# EAGLE design control_psw (EAGLE 7.4.0)
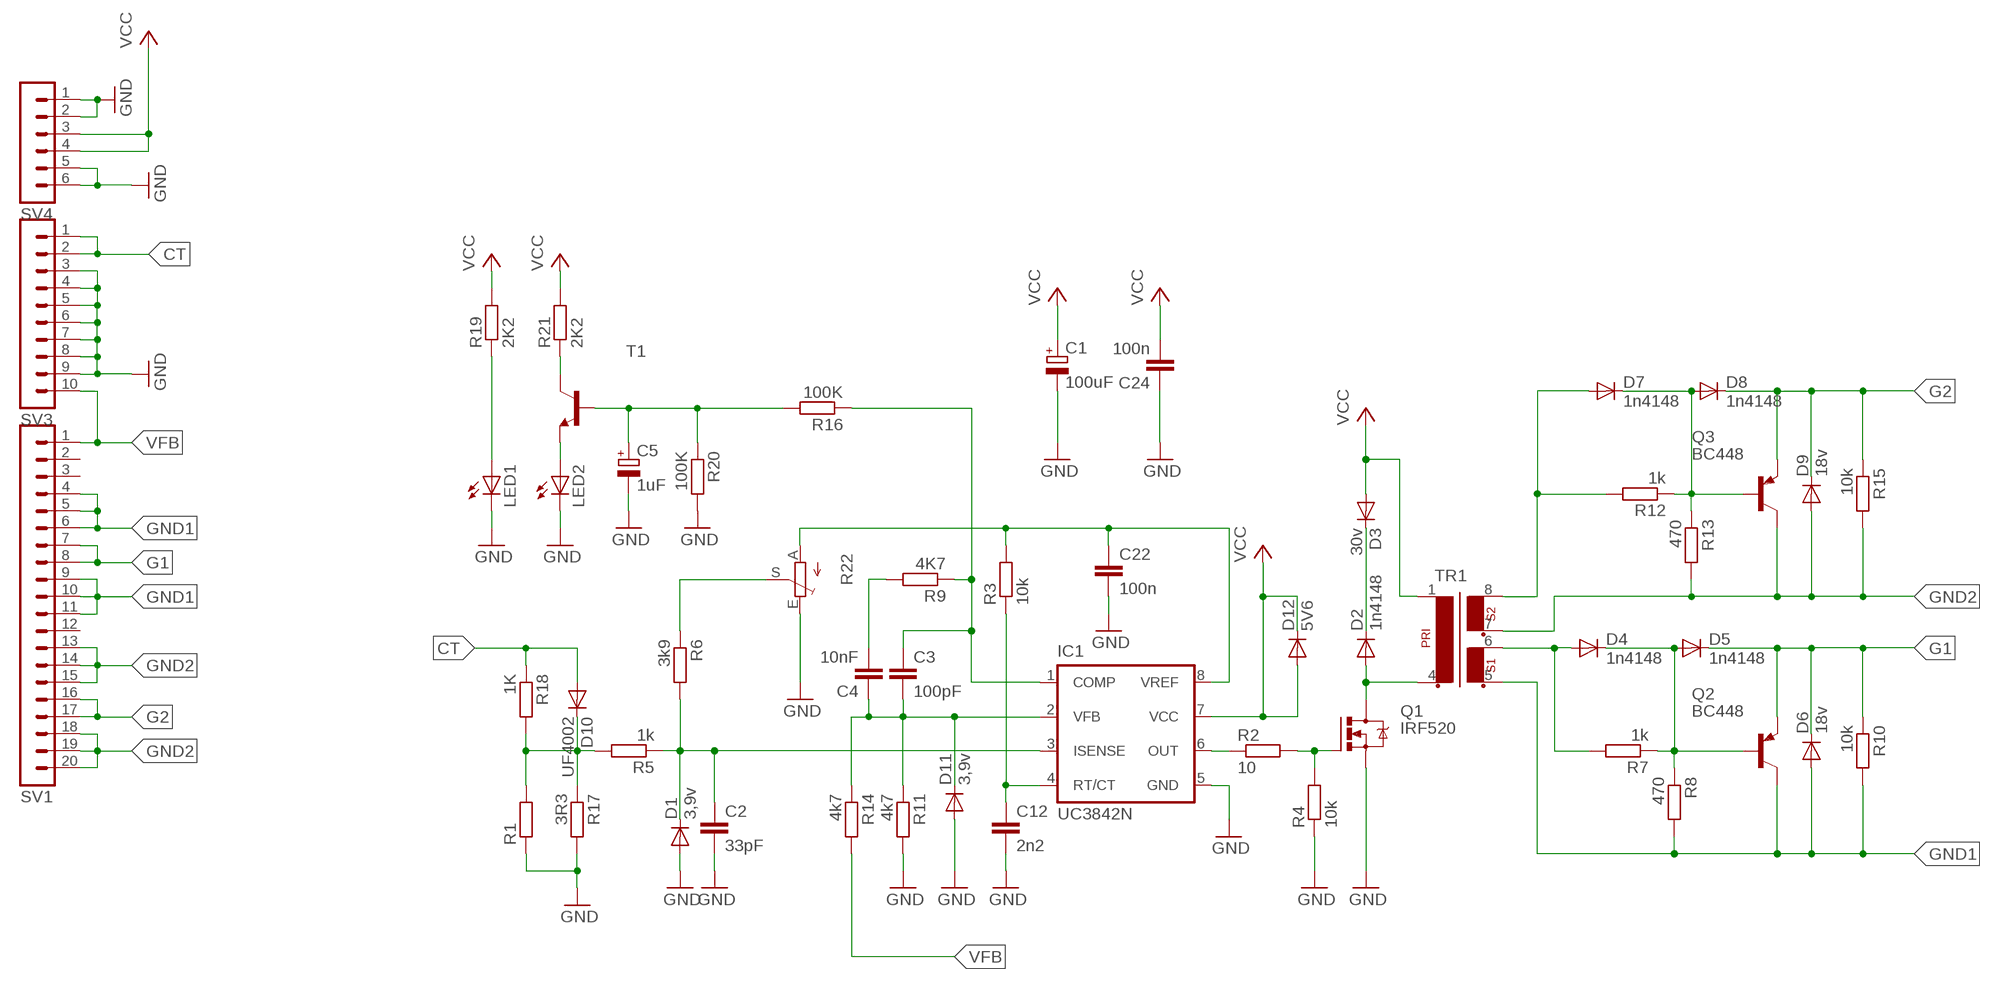
[diagram p0: schematic, sheet 1]

## Parts
C1  100uF  CPOL-EUE5-6  [E5-6]
C2  33pF  C-EU050-025X075  [C050-025X075]
C3  100pF  C-EU050-025X075  [C050-025X075]
C4  10nF  C-EU050-025X075  [C050-025X075]
C5  1uF  CPOL-EUE5-6  [E5-6]
C12  2n2  C-EU050-025X075  [C050-025X075]
C22  100n  C-EU050-025X075  [C050-025X075]
C24  100n  C-EU050-025X075  [C050-025X075]
D1  3,9v  1N4446  [DO35-10]
D2  1n4148  1N4446  [DO35-10]
D3  30v  1N4446  [DO35-10]
D4  1n4148  1N4446  [DO35-10]
D5  1n4148  1N4446  [DO35-10]
D6  18v  1N4446  [DO35-10]
D7  1n4148  1N4446  [DO35-10]
D8  1n4148  1N4446  [DO35-10]
D9  18v  1N4446  [DO35-10]
D10  UF4002  1N4446  [DO35-10]
D11  3,9v  1N4446  [DO35-10]
D12  5V6  1N4446  [DO35-10]
IC1  UC3842N  [DIL08]
LED1  LED5MM  [LED5MM]
LED2  LED5MM  [LED5MM]
Q1  IRF520  [TO220BV]
Q2  BC448  [TO92-EBC]
Q3  BC448  [TO92-EBC]
R1  R-EU_0411/12  [0411/12]
R2  10  R-EU_0207/10  [0207/10]
R3  10k  R-EU_0207/10  [0207/10]
R4  10k  R-EU_0207/10  [0207/10]
R5  1k  R-EU_0207/10  [0207/10]
R6  3k9  R-EU_0207/10  [0207/10]
R7  1k  R-EU_0207/10  [0207/10]
R8  470  R-EU_0207/10  [0207/10]
R9  4K7  R-EU_0207/10  [0207/10]
R10  10k  R-EU_0207/10  [0207/10]
R11  4k7  R-EU_0207/10  [0207/10]
R12  1k  R-EU_0207/10  [0207/10]
R13  470  R-EU_0207/10  [0207/10]
R14  4k7  R-EU_0207/10  [0207/10]
R15  10k  R-EU_0207/10  [0207/10]
R16  100K  R-EU_0207/10  [0207/10]
R17  3R3  R-EU_0207/10  [0207/10]
R18  1K  R-EU_0207/10  [0207/10]
R19  2K2  R-EU_0207/10  [0207/10]
R20  100K  R-EU_0207/10  [0207/10]
R21  2K2  R-EU_0207/10  [0207/10]
R22  TRIM_EU-RJ9W  [RJ9W]
SV1  MA20-1  [MA20-1]
SV3  MA10-1  [MA10-1]
SV4  MA06-1  [MA06-1]
T1  BC547-NPN-TO92-CBE  [TO92-CBE]
TR1  EE20-2  [EE20-2]

## Nets
CT: D10.A R18.1 SV3.1 SV3.2
G1: D5.C D6.C Q2.E R10.1 SV1.7 SV1.8
G2: D8.C D9.C Q3.E R15.1 SV1.16 SV1.17
GND: C1.- C2.2 C5.- C12.2 C22.2 C24.1 D1.A D11.A IC1.5(GND) LED1.K(C) LED2.K(C) Q1.S R1.1 R4.1 R11.2 R17.2 R20.2 R22.E SV3.3 SV3.4 SV3.5 SV3.6 SV3.7 SV3.8 SV3.9 SV4.1 SV4.2 SV4.5 SV4.6
GND1: D6.A Q2.C R8.2 R10.2 SV1.4 SV1.5 SV1.6 SV1.9 SV1.10 SV1.11 TR1.5
GND2: D9.A Q3.C R13.2 R15.2 SV1.13 SV1.14 SV1.15 SV1.18 SV1.19 SV1.20 TR1.7
N$1: C22.1 IC1.8(VREF) R3.2 R22.A
N$2: C12.1 IC1.4(RT/CT) R3.1
N$3: IC1.6(OUT) R2.1
N$4: Q1.G R2.2 R4.2
N$5: C2.1 D1.C IC1.3(ISENSE) R5.1 R6.2
N$6: D2.A Q1.D TR1.4
N$7: R6.1 R22.S
N$8: D2.C D3.C
N$9: LED1.A R19.1
N$10: C3.1 IC1.1(COMP) R9.1 R16.1
N$11: D4.C D5.A Q2.B R7.1 R8.1
N$12: D4.A R7.2 TR1.6
N$14: C3.2 C4.1 D11.C IC1.2(VFB) R11.1 R14.1
N$15: C4.2 R9.2
N$16: LED2.A T1.E
N$17: D7.C D8.A Q3.B R12.1 R13.1
N$18: D7.A R12.2 TR1.8
N$20: R21.1 T1.C
N$22: D10.C R1.2 R5.2 R17.1 R18.2
N$24: C5.+ R16.2 R20.1 T1.B
VCC: C1.+ C24.2 D3.A D12.A D12.C IC1.7(VCC) R19.2 R21.2 SV4.3 SV4.4 TR1.1
VFB: R14.2 SV1.1 SV3.10
Unconnected: SV1.2 SV1.3 SV1.12

## Library data of the parts
C1 C5 = rcl:CPOL-EU: POLARIZED CAPACITOR, European symbol
C2-C4 C12 C22 C24 = rcl:C-EU: CAPACITOR, European symbol
D1-D12 = diode:1N4446: DIODE high speed (Philips)
IC1 = v-reg:UC384*: SMPS Controller Source: http://www.fairchildsemi.com/ds/UC/UC3843.pdf
LED1 LED2 = led:LED: LED OSRAM: - CHIPLED LG R971, LG N971, LY N971, LG Q971, LY Q971, LO R971, LY R971 LH N974, LH R974 LS Q976, LO Q976, LY Q976 LO Q996 - Hyper CHIPLED LW Q18S LB Q993, LB Q99A, LB R99A - SideLED LS A670, LO A670, LY A670, LG A670, LP A670 LB A673, LV A673, LT A673, LW A673 LH A674 LY A675 LS A676, LA A676, LO A676, LY A676, LW A676 LS A679, LY A679, LG A679 - Hyper Micro SIDELED® LS Y876, LA Y876, LO Y876, LY Y876 LT Y87S - SmartLED LW L88C, LW L88S LB L89C, LB L89S, LG L890 LS L89K, LO L89K, LY L89K LS L896, LA L896, LO L896, LY L896 - TOPLED LS T670, LO T670, LY T670, LG T670, LP T670 LSG T670, LSP T670, LSY T670, LOP T670, LYG T670 LG T671, LOG T671, LSG T671 LB T673, LV T673, LT T673, LW T673 LH T674 LS T676, LA T676, LO T676, LY T676, LB T676, LH T676, LSB T676, LW T676 LB T67C, LV T67C, LT T67C, LS T67K, LO T67K, LY T67K, LW E67C LS E67B, LA E67B, LO E67B, LY E67B, LB E67C, LV E67C, LT E67C LW T67C LS T679, LY T679, LG T679 LS T770, LO T770, LY T770, LG T770, LP T770 LB T773, LV T773, LT T773, LW T773 LH T774 LS E675, LA E675, LY E675, LS T675 LS T776, LA T776, LO T776, LY T776, LB T776 LHGB T686 LT T68C, LB T68C - Hyper Mini TOPLED® LB M676 - Mini TOPLED Santana® LG M470 LS M47K, LO M47K, LY M47K Source: http://www.osram.convergy.de LUXEON: - LUMILED® LXK2-PW12-R00, LXK2-PW12-S00, LXK2-PW14-U00, LXK2-PW14-V00 LXK2-PM12-R00, LXK2-PM12-S00, LXK2-PM14-U00 LXK2-PE12-Q00, LXK2-PE12-R00, LXK2-PE12-S00, LXK2-PE14-T00, LXK2-PE14-U00 LXK2-PB12-K00, LXK2-PB12-L00, LXK2-PB12-M00, LXK2-PB14-N00, LXK2-PB14-P00, LXK2-PB14-Q00 LXK2-PR12-L00, LXK2-PR12-M00, LXK2-PR14-Q00, LXK2-PR14-R00 LXK2-PD12-Q00, LXK2-PD12-R00, LXK2-PD12-S00 LXK2-PH12-R00, LXK2-PH12-S00 LXK2-PL12-P00, LXK2-PL12-Q00, LXK2-PL12-R00 Source: www.luxeon.com KINGBRIGHT: KA-3528ASYC Source: www.kingbright.com
Q1 = transistor-power:IRF520: HEXFET Power MOSFET
Q2 Q3 = transistor-pnp:BC448*: PNP Transistror
R1-R21 = rcl:R-EU_: RESISTOR, European symbol
R22 = pot:TRIM_EU-: POTENTIOMETER
SV1 = con-lstb:MA20-1: PIN HEADER; OC_FARNELL: unknown; OC_NEWARK: unknown
SV3 = con-lstb:MA10-1: PIN HEADER; OC_FARNELL: unknown; OC_NEWARK: unknown
SV4 = con-lstb:MA06-1: PIN HEADER; OC_FARNELL: unknown; OC_NEWARK: unknown
T1 = transistor:*-NPN-: NPN Transistror BF959 corrected 2008.03.06
TR1 = trafo:EE20-2: TRANSFORMER 1 primary winding, 2 secondary windings ERA

## Board
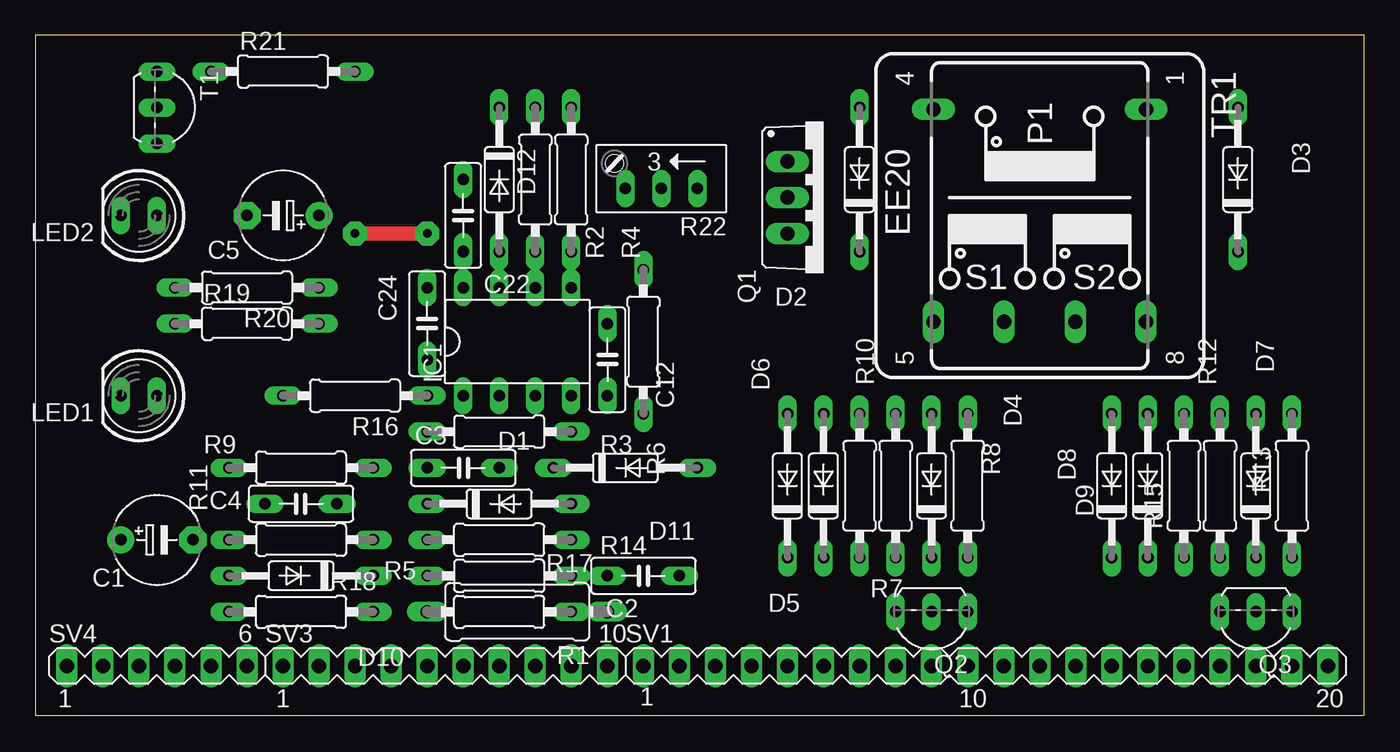
[diagram p1: board, top side]
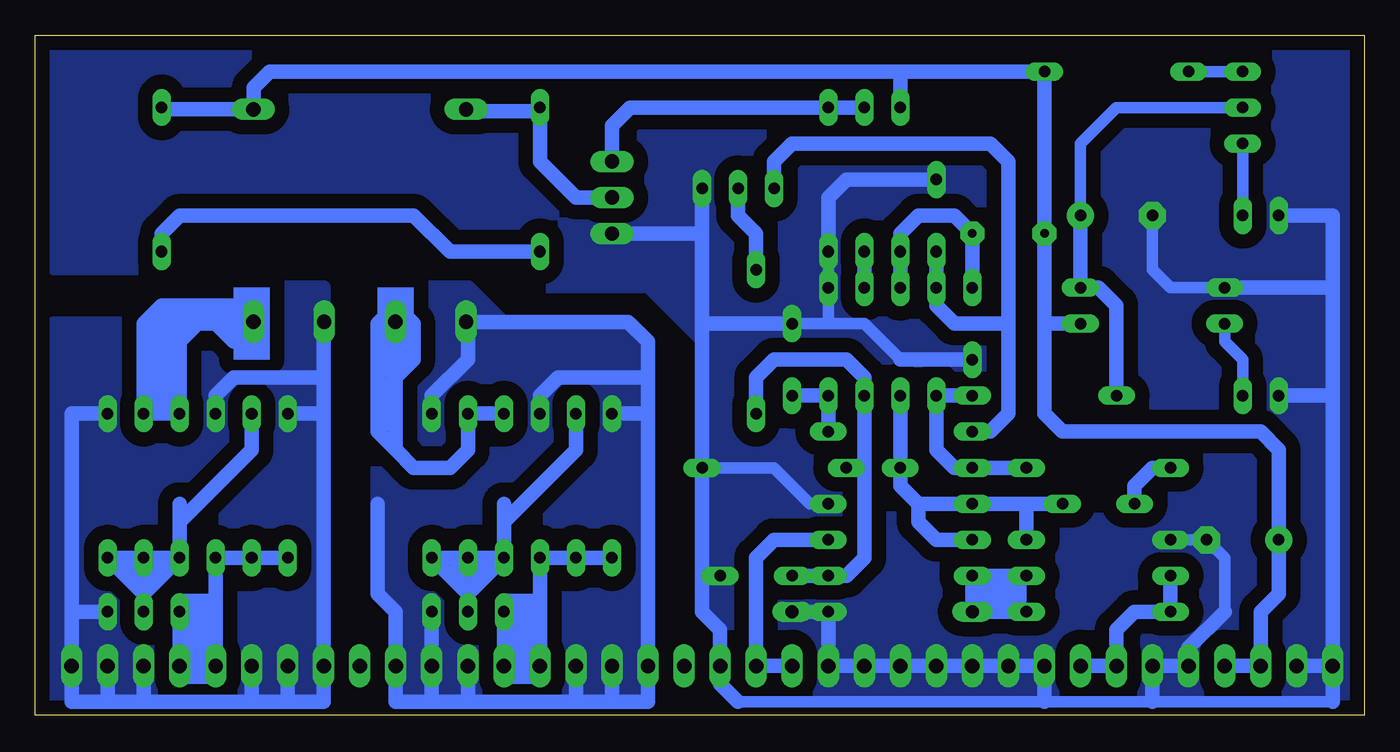
[diagram p2: board, bottom side, seen from below]

Size 93.65 x 47.93 mm. Coordinates in mm from the lower left corner, seen from the top.
Outline: 93.65,47.93 0,47.93 0,0 93.65,0 93.65,47.93
Copper layers (1*16): Top 0.035mm / dielectric 1.5mm / Bottom 0.035mm
Design rules "default": minimum track width 10mil, minimum drill 24mil, track to track 8mil, track to pad 8mil, pad to pad 8mil, via to via 8mil, smd to smd 8mil, copper to edge 40mil, drill to drill 8mil, minimum pad ring 10mil, minimum via ring 8mil, stop-mask expansion 4mil, vias tented up to drill 0mil, thermal gap 10mil

### Footprints (pad centres in the part's own frame; a part is rotated, then mirrored left to right if it is on the bottom)
E5-6 = drill 0.813 pad 1.905: + -2.54,0 | drill 0.813 pad 1.905 octagon: - 2.54,0
C050-025X075 = drill 0.813 long: 1 -2.54,0; 2 2.54,0
DO35-10 = drill 0.813 long: A 5.08,0; C -5.08,0
DIL08 = drill 0.813 long: 1 -3.81,-3.81; 2 -1.27,-3.81; 3 1.27,-3.81; 4 3.81,-3.81; 5 3.81,3.81; 6 1.27,3.81; 7 -1.27,3.81; 8 -3.81,3.81
LED5MM = drill 0.813 long: A -1.27,0; K 1.27,0
TO220BV = drill 1.016 long: D 0,-2.54; G -2.54,-2.54; S 2.54,-2.54
TO92-EBC = drill 0.813 long: B 0,-1.27; C -2.54,-1.27; E 2.54,-1.27
0411/12 = drill 0.914 long: 1 -6.35,0; 2 6.35,0
0207/10 = drill 0.813 long: 1 -5.08,0; 2 5.08,0
RJ9W = drill 0.813 long: A 2.54,0.635; E -2.54,0.635; S 0,0.635
MA20-1 = drill 1.016 long: 1 -24.13,0; 2 -21.59,0; 3 -19.05,0; 4 -16.51,0; 5 -13.97,0; 6 -11.43,0; 7 -8.89,0; 8 -6.35,0; 9 -3.81,0; 10 -1.27,0; 11 1.27,0; 12 3.81,0; 13 6.35,0; 14 8.89,0; 15 11.43,0; 16 13.97,0; 17 16.51,0; 18 19.05,0; 19 21.59,0; 20 24.13,0
MA10-1 = drill 1.016 long: 1 -11.43,0; 2 -8.89,0; 3 -6.35,0; 4 -3.81,0; 5 -1.27,0; 6 1.27,0; 7 3.81,0; 8 6.35,0; 9 8.89,0; 10 11.43,0
MA06-1 = drill 1.016 long: 1 -6.35,0; 2 -3.81,0; 3 -1.27,0; 4 1.27,0; 5 3.81,0; 6 6.35,0
TO92-CBE = drill 0.813 long: B 0,0; C -2.54,0; E 2.54,0
EE20-2 = drill 1.016 long: 1 -7.493,7.493; 4 -7.493,-7.493; 5 7.493,-7.493; 6 7.493,-2.515; 7 7.493,2.515; 8 7.493,7.493

### Placement (x,y rotation side)
C1  8.56,12.37 0 top
C2  42.85,9.83 0 top
C3  30.15,17.45 0 top
C4  18.72,14.91 180 top
C5  17.45,35.23 180 top
C12  40.31,25.07 90 top
C22  30.15,35.23 90 top
C24  27.61,27.61 90 top
D1  41.58,17.45 0 top
D2  58.09,37.77 90 top
D3  84.76,37.77 90 top
D4  63.17,16.18 90 top
D5  55.55,16.18 90 top
D6  53.01,16.18 90 top
D7  86.03,16.18 90 top
D8  78.41,16.18 90 top
D9  75.87,16.18 90 top
D10  18.72,9.83 180 top
D11  32.69,14.91 0 top
D12  32.69,37.77 270 top
IC1  33.96,26.34 0 top
LED1  7.29,22.53 180 top
LED2  7.29,35.23 180 top
Q1  55.55,36.5 270 top
Q2  63.17,6.02 180 top
Q3  86.03,6.02 180 top
R1  33.96,7.29 180 top
R2  35.23,37.77 90 top
R3  32.69,19.99 180 top
R4  37.77,37.77 90 top
R5  32.69,9.83 180 top
R6  42.85,26.34 270 top
R7  60.63,16.18 90 top
R8  65.71,16.18 90 top
R9  18.72,17.45 180 top
R10  58.09,16.18 90 top
R11  18.72,12.37 180 top
R12  83.49,16.18 90 top
R13  88.57,16.18 90 top
R14  32.69,12.37 0 top
R15  80.95,16.18 90 top
R16  22.53,22.53 180 top
R17  32.69,7.29 0 top
R18  18.72,7.29 0 top
R19  14.91,27.61 0 top
R20  14.91,30.15 180 top
R21  17.45,45.39 0 top
R22  44.12,37.77 180 top
SV1  66.98,3.48 0 top
SV3  28.88,3.48 0 top
SV4  8.56,3.48 0 top
T1  8.56,42.85 270 top
TR1  70.79,35.23 270 top

### Tracks (layer width: path | path; a pad name or v marks a point on that pad's centre or on a via)
CT
  Bottom 1.016: SV3.2 SV3.1 17.45,6.02 16.18,7.29 R18.1 D10.A
G1
  Bottom 1.016: D6.C D5.C R10.1 58.09,7.29 | 58.09,7.29 SV1.7 | 58.09,7.29 Q2.E SV1.8
G2
  Bottom 1.016: D9.C D8.C R15.1 SV1.16 SV1.17 Q3.E
GND
  Bottom 0.813: 32.69,25.07 35.23,27.61 37.77,27.61 | R20.2 13.64,30.15 14.91,31.42 C5.- | R11.2 C1.- 9.83,11.1 9.83,7.29 | 2.21,0.94 14.91,0.94 22.53,0.94 44.12,0.94 | D11.A 39.04,14.91 41.58,17.45 D1.A | 37.77,27.61 IC1.5 R4.1 | C12.2 37.77,27.61
  Bottom 1.016: R4.1 37.77,36.5 36.5,37.77 C22.2 | 44.12,0.94 45.39,2.21 45.39,6.02 46.66,7.29 46.66,9.83 | 46.66,9.83 D1.A 46.66,27.61 | C2.2 46.66,9.83 | R22.E 46.66,33.96 | 46.66,33.96 46.66,27.61 | C12.2 46.66,27.61 | Q1.S 46.66,33.96 | LED2.K 2.21,35.23 2.21,30.15 | R20.2 2.21,30.15 | LED1.K 2.21,22.53 | 2.21,22.53 SV4.1 | SV4.1 2.21,0.94 | 2.21,30.15 2.21,22.53 | C24.1 32.69,25.07 | SV4.2 SV4.1 | 14.91,0.94 SV4.6 SV4.5 12.37,4.75 9.83,7.29 | 22.53,0.94 SV3.3 SV3.4 SV3.5 SV3.6 SV3.7 SV3.8 SV3.9 R17.2 R1.1
  pour Bottom (isolate 1.016, no thermals): -0.33,0.94 44.12,0.94 45.39,2.21 45.39,6.02 46.66,7.29 46.66,26.34 50.47,30.15 59.36,30.15 61.9,32.69 83.49,32.69 84.76,31.42 92.38,31.42 93.65,32.69 93.65,47.93 -0.33,47.93
GND1
  Bottom 1.016: 69.52,14.91 69.52,8.56 68.25,7.29 SV1.11 68.25,0.94 65.71,0.94 | 50.47,23.8 50.47,26.34 51.87,27.74 TR1.5 63.17,27.61 63.17,25.07 65.71,22.53 R8.2 | 50.47,23.8 50.47,21.26 | 50.47,21.26 SV1.4 50.47,0.94 53.01,0.94 | 53.01,0.94 55.55,0.94 | 65.71,0.94 63.17,0.94 | 63.17,0.94 55.55,0.94 | Q2.C SV1.10 65.71,0.94 | R10.2 58.09,22.53 56.82,23.8 50.47,23.8 | D6.A 50.47,21.26 | SV1.6 55.55,0.94 | SV1.5 53.01,0.94 | SV1.9 63.17,0.94
  pour Bottom (isolate 1.016, no thermals): 68.25,0.94 68.25,7.29 69.52,8.56 69.52,30.15 63.17,30.15 60.63,27.61 51.74,27.61 50.47,26.34 50.47,0.94
GND2
  Bottom 1.016: D9.A 73.33,21.26 | 73.33,21.26 SV1.13 73.33,0.94 75.87,0.94 | 78.41,0.94 75.87,0.94 | 91.11,7.29 SV1.20 91.11,0.94 88.57,0.94 | 88.57,0.94 86.03,0.94 | 86.03,0.94 78.41,0.94 | 73.33,21.26 73.33,23.8 | 73.33,23.8 73.33,27.71 TR1.7 | Q3.C 91.11,7.29 | R13.2 91.11,21.26 91.11,7.29 | R15.2 80.95,22.53 79.68,23.8 73.33,23.8 | SV1.15 78.41,0.94 | SV1.14 75.87,0.94 | SV1.18 86.03,0.94 | SV1.19 88.57,0.94
  pour Bottom (isolate 1.016, no thermals): 92.38,0.94 92.38,27.61 86.03,27.61 83.49,30.15 73.33,30.15 73.33,0.94
N$1
  Bottom 1.016: R3.2 26.34,19.99 25.07,21.26 25.07,27.61 | R22.A 41.58,39.04 40.31,40.31 26.34,40.31 25.07,39.04 25.07,27.61 | 25.07,27.61 28.88,27.61 30.15,28.88 IC1.8 C22.1
N$2
  Bottom 1.016: C12.1 IC1.4 R3.1
N$3
  Bottom 1.016: R2.1 IC1.6
N$4
  Bottom 1.016: R2.2 R4.2 51.74,42.85 53.01,41.58 Q1.G
N$5
  Bottom 1.016: 35.23,17.45 IC1.3 35.23,23.8 36.5,25.07 41.58,25.07 42.85,23.8 R6.2 | 35.23,17.45 35.23,11.1 36.5,9.83 R5.1 C2.1 | D1.C 35.23,17.45
N$6
  Bottom 1.016: TR1.4 63.17,42.6 58.34,42.6 D2.A 58.09,39.04 55.55,36.5 Q1.D
N$7
  Bottom 1.016: R22.S 44.12,35.23 42.85,33.96 R6.1
N$8
  Bottom 1.016: D3.C 84.76,33.96 83.49,35.23 66.98,35.23 64.44,32.69 D2.C
N$9
  Bottom 0.813: LED1.A 8.56,25.07 9.83,26.34 R19.1
N$10
  Bottom 1.016: R9.1 C3.1 28.88,17.45 30.15,18.72 IC1.1 R16.1
N$11
  Bottom 1.016: 63.17,8.56 63.17,9.83 | 63.17,9.83 D4.C | 60.63,14.91 60.63,13.64 | 60.63,13.64 R7.1 | Q2.B 63.17,8.56 | 63.17,8.56 64.44,9.83 | 64.44,9.83 R8.1 D4.C | D4.C 61.9,11.1 | 61.9,11.1 R7.1 | R7.1 61.9,9.83 | 61.9,9.83 63.17,8.56 | 64.44,9.83 D4.C | D4.C 61.9,9.83 | 61.9,9.83 61.9,11.1 | 63.17,9.83 61.9,9.83 | 63.17,9.83 64.44,9.83 | D5.A 55.55,18.72 60.63,13.64
N$12
  Bottom 1.016: R7.2 D4.A 63.17,18.72 64.44,17.45 66.98,17.45 68.28,18.75 | TR1.6 68.28,18.75 | 68.28,18.75 69.52,19.99 | 69.52,19.99 69.52,21.26 | 69.52,21.26 69.52,22.53 | 69.52,22.53 69.52,25.07 | 69.52,25.07 69.52,27.61 68.25,28.88 66.98,27.61 66.98,25.07 | 66.98,25.07 68.25,23.8 | 68.25,23.8 69.52,25.07 | 69.52,25.07 66.98,25.07 | 68.25,23.8 69.52,22.53 | 69.52,22.53 68.25,22.53 69.52,21.26 | 69.52,21.26 68.25,21.26 69.52,19.99
N$14
  Bottom 1.016: IC1.2 C3.2 32.69,16.18 31.42,14.91 | C4.1 23.8,14.91 | 23.8,14.91 D11.C 31.42,14.91 | R11.1 23.8,14.91 | R14.1 30.15,12.37 31.42,13.64 31.42,14.91
N$15
  Bottom 1.016: C4.2 16.18,16.18 14.91,17.45 R9.2
N$16
  Bottom 0.813: T1.E LED2.A
N$17
  Bottom 1.016: 86.03,8.56 D7.C | 83.49,14.91 83.49,13.64 | 83.49,13.64 R12.1 | Q3.B 86.03,8.56 | 86.03,8.56 87.3,9.83 | 87.3,9.83 R13.1 87.3,11.1 | 87.3,11.1 D7.C | 84.76,11.1 R12.1 | R12.1 84.76,9.83 | 86.03,8.56 84.76,9.83 | 84.76,9.83 D7.C | D7.C 87.3,9.83 | 87.3,9.83 84.76,9.83 | 84.76,9.83 84.76,11.1 | 84.76,11.1 D7.C | 87.3,11.1 87.3,9.83 | D8.A 78.41,18.72 83.49,13.64
N$18
  Bottom 1.016: TR1.8 82.09,27.74 | 82.09,27.74 82.22,27.61 | 82.22,27.61 83.49,26.34 | D7.A 86.03,23.8 | 86.03,26.34 86.03,27.61 84.76,28.88 83.49,28.88 | 79.68,28.88 78.41,28.88 78.41,26.34 79.68,26.34 | 79.68,26.34 80.95,27.61 | 80.95,27.61 79.68,27.61 | 79.68,27.61 79.68,26.34 | 79.68,27.61 79.68,28.88 | 80.95,28.88 82.22,28.88 | 82.22,28.88 83.49,28.88 | 83.49,28.88 84.76,27.61 | 84.76,27.61 83.49,27.61 | 83.49,27.61 82.22,27.61 | 82.22,27.61 80.95,27.61 | 80.95,27.61 79.68,28.88 | 79.68,28.88 80.95,28.88 | 80.95,28.88 82.09,27.74 | 82.22,27.61 82.22,28.88 | 82.22,28.88 83.49,27.61 | 83.49,27.61 84.76,26.34 | 84.76,26.34 84.76,23.8 | 84.76,23.8 84.76,22.53 | 84.76,22.53 84.76,21.26 | 84.76,21.26 R12.2 83.49,22.53 | 83.49,22.53 83.49,23.8 | 83.49,25.07 83.49,26.34 | 84.76,27.61 83.49,26.34 | 83.49,26.34 84.76,26.34 | 84.76,26.34 86.03,26.34 | 86.03,26.34 86.03,25.07 | 86.03,25.07 84.76,25.07 83.49,26.34 | 84.76,27.61 86.03,26.34 | 86.03,26.34 83.49,23.8 | 83.49,23.8 84.76,23.8 | 84.76,23.8 86.03,25.07 | 86.03,25.07 86.03,23.8 | 86.03,23.8 84.76,22.53 | D7.A 84.76,21.26 | 84.76,21.26 83.49,22.53 | 83.49,22.53 84.76,22.53 | 84.76,22.53 D7.A | D7.A 86.03,22.53 84.76,23.8 | 84.76,23.8 83.49,22.53 | 83.49,23.8 83.49,25.07 | 83.49,25.07 84.76,26.34
N$20
  Bottom 0.813: T1.C R21.1
N$22
  Bottom 1.016: D10.C R5.2 R1.2 R18.2
N$24
  Bottom 0.813: T1.B 17.45,42.85 19.99,40.31 C5.+
  Bottom 1.016: R16.2 17.45,28.88 18.72,30.15 R20.1 C5.+
VCC  (via drill 0.6 pad 1.68)
  Top 1.016: v27.61,33.96 v22.53,33.96
  Bottom 1.016: 32.69,45.39 77.14,45.39 78.28,44.25 TR1.1 84.63,42.72 D3.A | D12.C 32.69,45.39 | 32.69,45.39 R21.2 v22.53,33.96 22.53,27.61 | 22.53,27.61 22.53,21.26 21.26,19.99 7.29,19.99 6.02,18.72 C1.+ 6.02,8.56 7.29,7.29 SV4.3 SV4.4 | R19.2 22.53,27.61 | C24.2 v27.61,33.96 28.88,35.23 31.42,35.23 32.69,33.96 D12.A IC1.7
VFB
  Bottom 1.016: R14.2 41.58,12.37 42.85,11.1 SV1.1 SV3.10
(copper drawn outside any net)
  shapes: Bottom area x7